# EAGLE design EXT_MAIN (EAGLE 6.5.0)
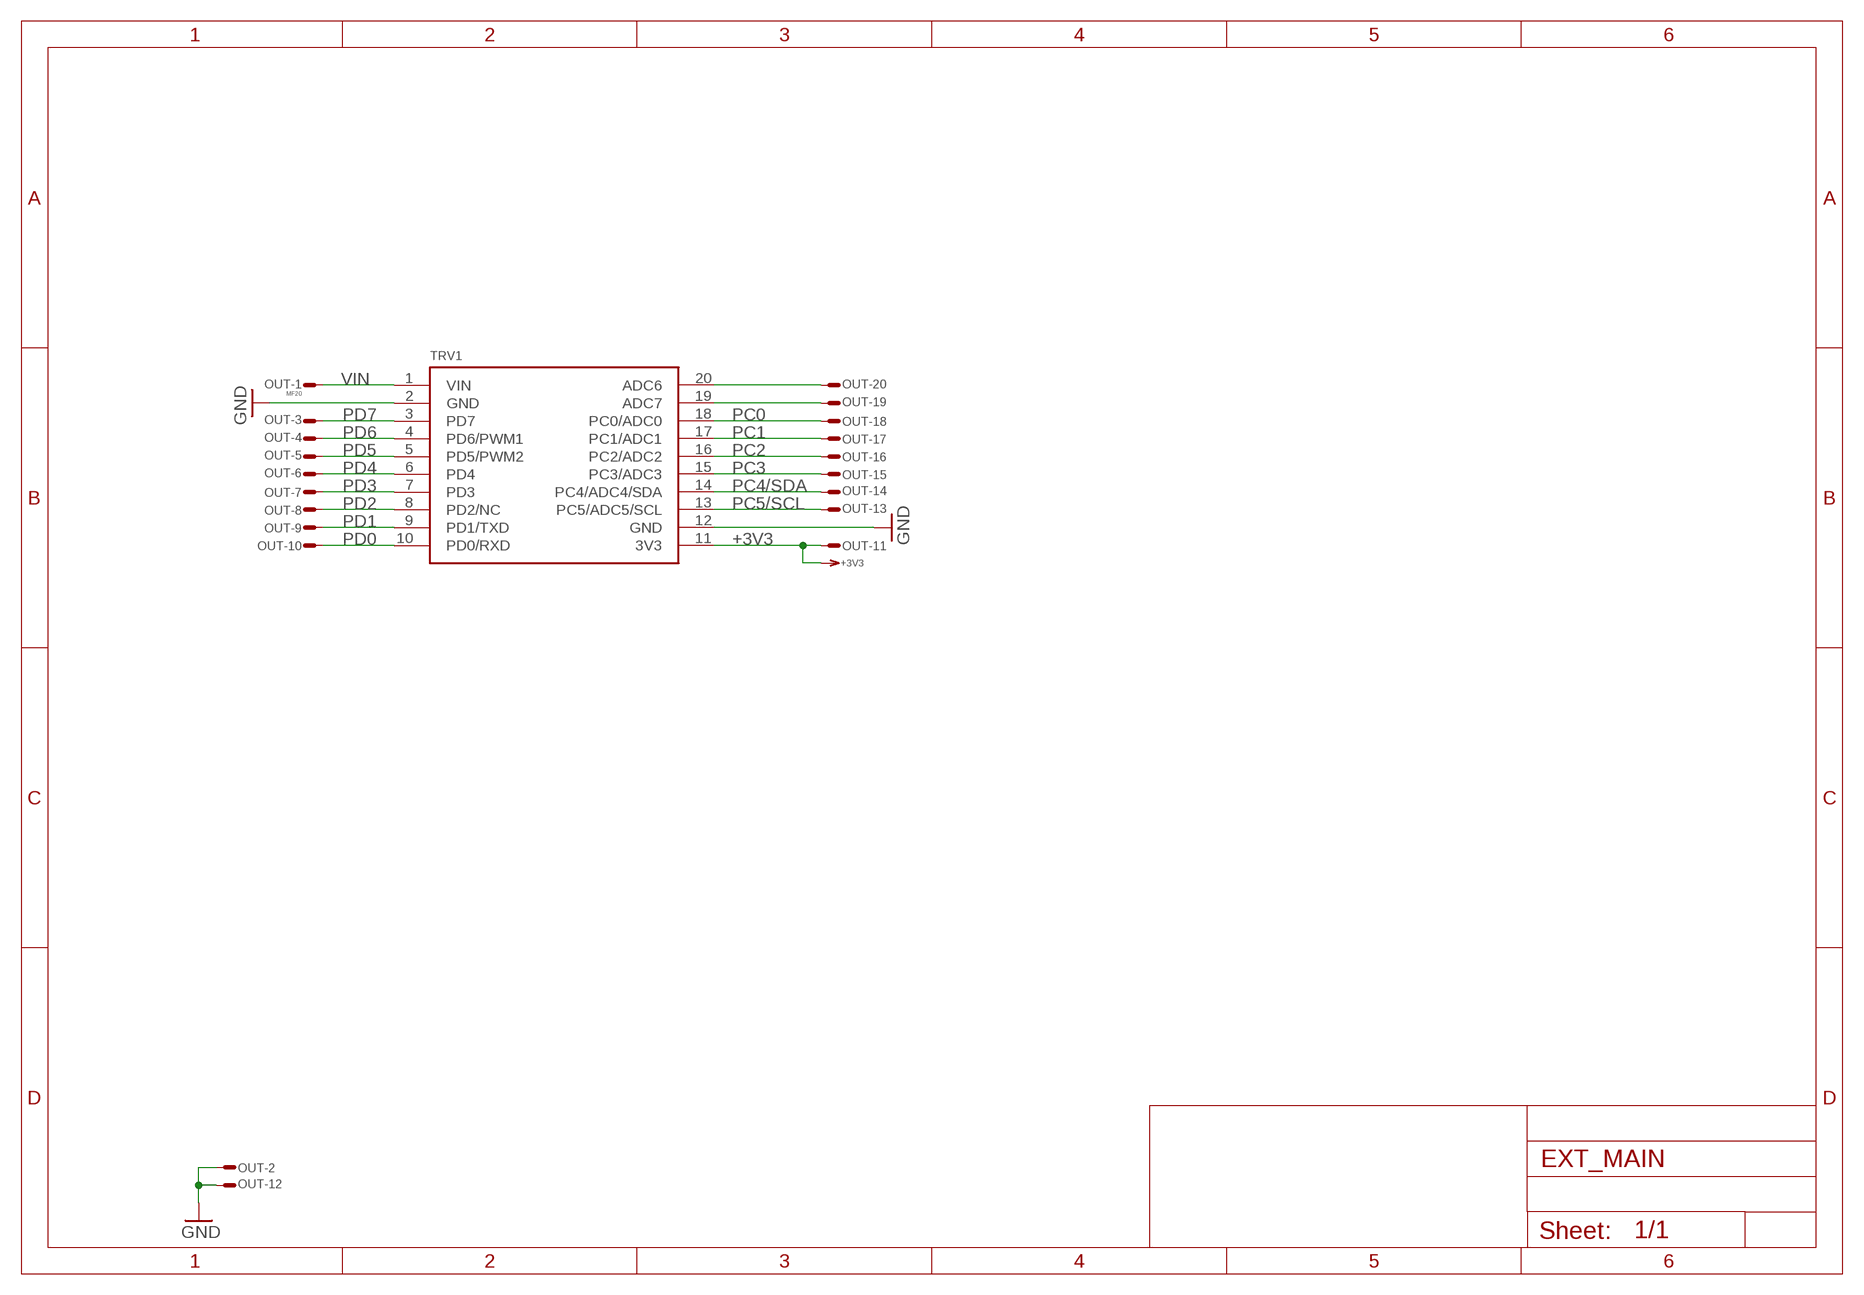
[diagram p0: schematic, sheet 1]

## Parts
OUT  MF20  ML20LSE  [ML20LS]
TRV1  X13_TRV  [X13TRV]

## Nets
+3V3: OUT.P$11 TRV1.11(3V3)
GND: OUT.P$2 OUT.P$12 TRV1.2(GND) TRV1.12(GND)
N$1: OUT.P$20 TRV1.20(ADC6)
N$3: OUT.P$19 TRV1.19(ADC7)
PC0: OUT.P$18 TRV1.18(PC0/ADC0)
PC1: OUT.P$17 TRV1.17(PC1/ADC1)
PC2: OUT.P$16 TRV1.16(PC2/ADC2)
PC3: OUT.P$15 TRV1.15(PC3/ADC3)
PC4/SDA: OUT.P$14 TRV1.14(PC4/ADC4/SDA)
PC5/SCL: OUT.P$13 TRV1.13(PC5/ADC5/SCL)
PD0: OUT.P$10 TRV1.10(PD0/RXD)
PD1: OUT.P$9 TRV1.9(PD1/TXD)
PD2: OUT.P$8 TRV1.8(PD2/NC)
PD3: OUT.P$7 TRV1.7(PD3)
PD4: OUT.P$6 TRV1.6(PD4)
PD5: OUT.P$5 TRV1.5(PD5/PWM2)
PD6: OUT.P$4 TRV1.4(PD6/PWM1)
PD7: OUT.P$3 TRV1.3(PD7)
VIN: OUT.P$1 TRV1.1(VIN)

## Library data of the parts
OUT = Conn:ML20?E: HARTING
TRV1 = Other:X13_TRV

## Board
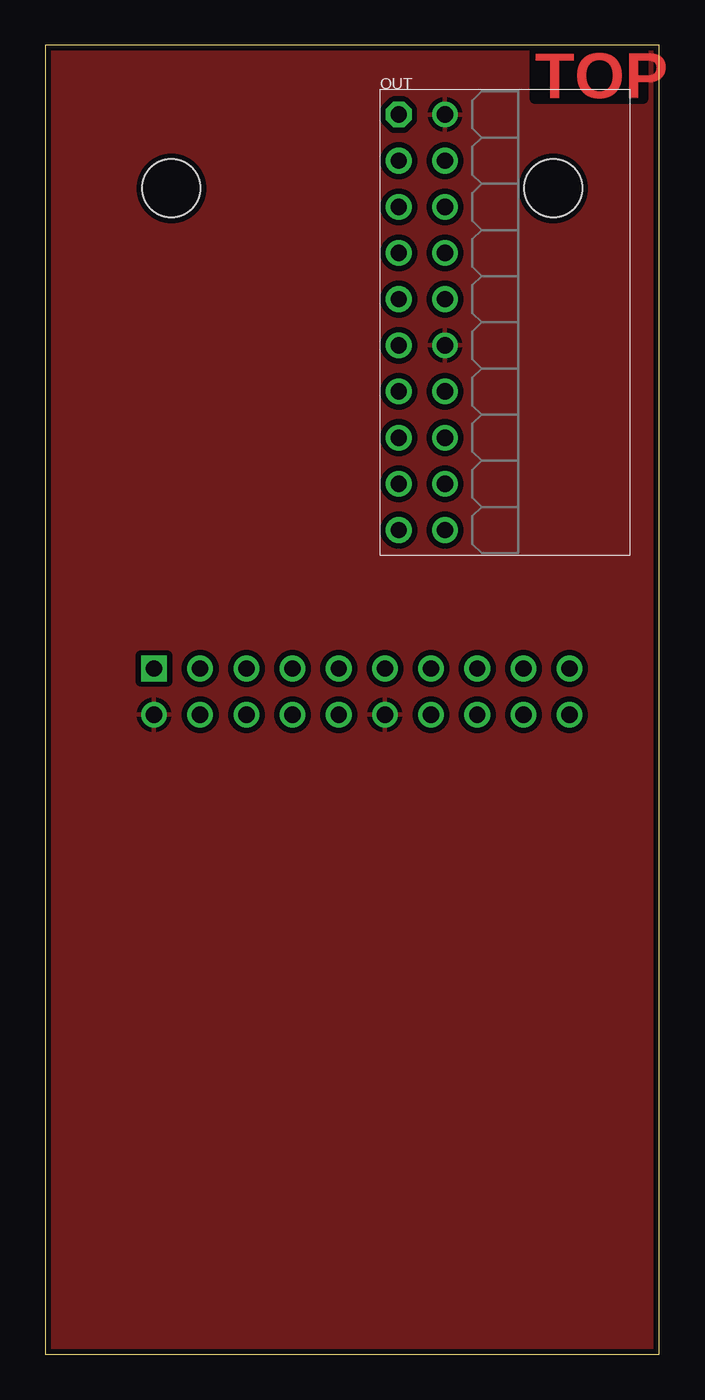
[diagram p1: board, top side]
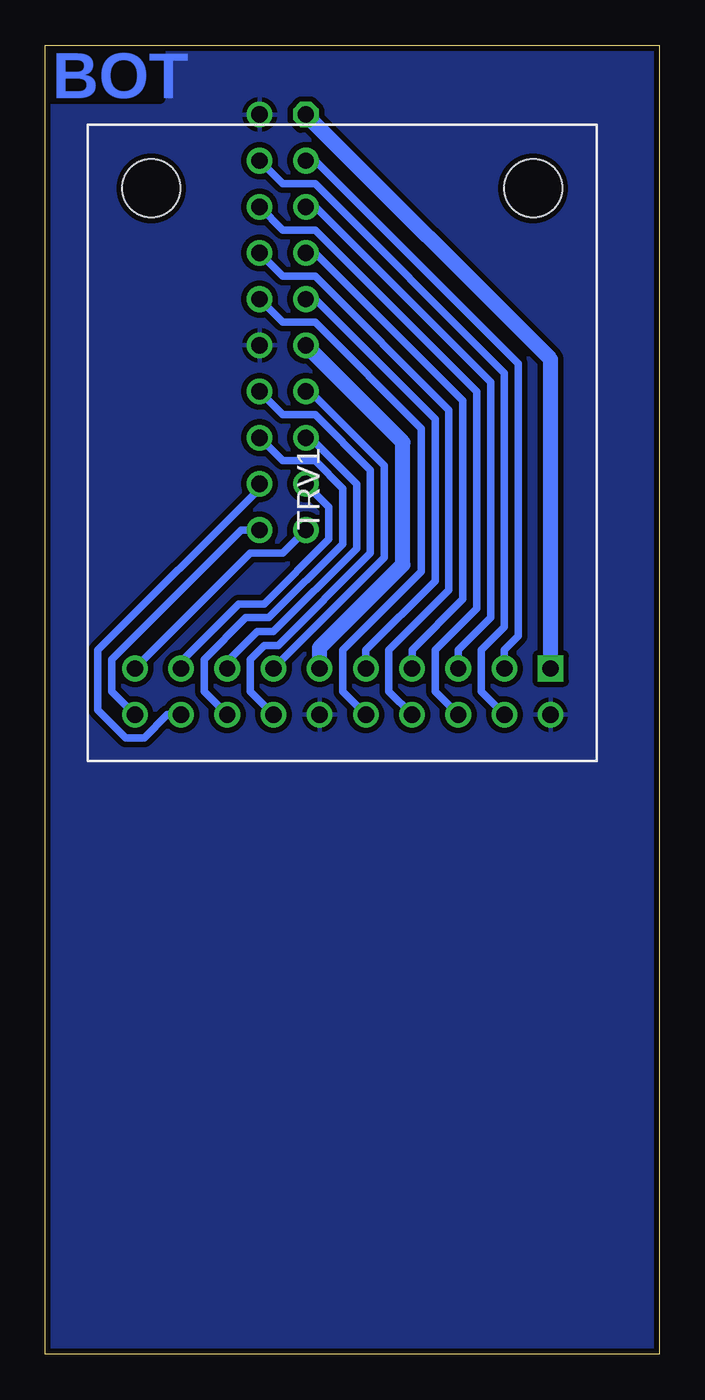
[diagram p2: board, bottom side, seen from below]

Size 33.75 x 72 mm. Coordinates in mm from the lower left corner, seen from the top.
Outline: 0,0 33.75,0 33.75,72 0,72 0,0
Copper layers (1*16): Top 0.035mm / dielectric 1.5mm / Bottom 0.035mm
Design rules "default *": minimum track width 10mil, minimum drill 10mil, track to track 12mil, track to pad 12mil, pad to pad 12mil, via to via 12mil, smd to smd 12mil, copper to edge 12mil, drill to drill 8mil, minimum pad ring 10mil, minimum via ring 8mil, stop-mask expansion 4mil, vias tented up to drill 0mil, thermal gap 10mil
tKeepout: area 0,0 to 33.8,2; area 0,70 to 33.8,72

### Footprints (pad centres in the part's own frame; a part is rotated, then mirrored left to right if it is on the bottom)
ML20LS = drill 0.9 octagon: P$1 -11.43,-1.27 | drill 0.9: P$2 -11.43,1.27; P$3 -8.89,-1.27; P$4 -8.89,1.27; P$5 -6.35,-1.27; P$6 -6.35,1.27; P$7 -3.81,-1.27; P$8 -3.81,1.27; P$9 -1.27,-1.27; P$10 -1.27,1.27; P$11 1.27,-1.27; P$12 1.27,1.27; P$13 3.81,-1.27; P$14 3.81,1.27; P$15 6.35,-1.27; P$16 6.35,1.27; P$17 8.89,-1.27; P$18 8.89,1.27; P$19 11.43,-1.27; P$20 11.43,1.27
X13TRV = drill 0.9 square: 1 5.08,2.54 | drill 0.9: 2 2.54,2.54; 3 5.08,5.08; 4 2.54,5.08; 5 5.08,7.62; 6 2.54,7.62; 7 5.08,10.16; 8 2.54,10.16; 9 5.08,12.7; 10 2.54,12.7; 11 5.08,15.24; 12 2.54,15.24; 13 5.08,17.78; 14 2.54,17.78; 15 5.08,20.32; 16 2.54,20.32; 17 5.08,22.86; 18 2.54,22.86; 19 5.08,25.4; 20 2.54,25.4 | hole 3.2: 31.5,3.5; 31.5,24.5

### Placement (x,y rotation side)
OUT  20.7,56.77 270 top
TRV1  3.43,32.64 90 bottom

### Tracks (layer width: path | path; a pad name or v marks a point on that pad's centre or on a via)
+3V3
  Bottom 0.813: TRV1.11 18.67,38.86 14.1,43.43 14.1,50.16 OUT.P$11
GND
  pour Bottom: 0,0.13 33.66,0.13 33.66,71.88 0,71.88
  pour Top: 0,0 33.66,0 33.66,71.88 0,71.88
N$1
  Bottom 0.406: TRV1.20 30.1,36.45 30.1,38.23 22.99,45.34 OUT.P$20
N$3
  Bottom 0.406: TRV1.19 22.48,44.07 20.7,44.07 OUT.P$19
PC0
  Bottom 0.406: TRV1.18 27.05,35.18 28.32,33.91 29.34,33.91 30.86,35.43 30.86,38.73 21.97,47.62 OUT.P$18
PC1
  Bottom 0.406: TRV1.17 26.29,38.1 23.11,41.27 21.72,41.27 18.16,44.83 18.16,46.61 OUT.P$17
PC2
  Bottom 0.406: TRV1.16 25.02,36.45 25.02,38.23 22.73,40.51 21.46,40.51 17.4,44.58 17.4,47.62 18.92,49.15 20.7,49.15 OUT.P$16
PC3
  Bottom 0.406: TRV1.15 23.75,38.1 22.1,39.75 21.21,39.75 16.64,44.32 16.64,47.88 19.18,50.42 OUT.P$15
PC4/SDA
  Bottom 0.406: TRV1.14 22.48,36.45 22.48,38.23 21.72,38.99 20.95,38.99 15.88,44.07 15.88,48.64 18.92,51.69 20.7,51.69 OUT.P$14
PC5/SCL
  Bottom 0.406: TRV1.13 15.11,43.81 15.11,48.9 19.18,52.96 OUT.P$13
PD0
  Bottom 0.406: TRV1.10 17.4,36.45 17.4,38.73 13.08,43.05 13.08,50.93 18.92,56.77 20.7,56.77 OUT.P$10
PD1
  Bottom 0.406: TRV1.9 16.13,38.73 12.32,42.55 12.32,51.44 18.92,58.04 OUT.P$9
PD2
  Bottom 0.406: TRV1.8 14.86,36.45 14.86,38.73 11.56,42.04 11.56,51.94 18.92,59.31 20.7,59.31 OUT.P$8
PD3
  Bottom 0.406: TRV1.7 13.59,38.73 10.79,41.53 10.79,52.45 18.92,60.58 OUT.P$7
PD4
  Bottom 0.406: TRV1.6 12.32,36.45 12.32,38.73 10.03,41.02 10.03,52.96 18.92,61.85 20.7,61.85 OUT.P$6
PD5
  Bottom 0.406: TRV1.5 11.05,38.73 9.27,40.51 9.27,53.47 18.92,63.12 OUT.P$5
PD6
  Bottom 0.406: TRV1.4 9.78,36.45 9.78,38.73 8.51,40.01 8.51,53.98 18.92,64.39 20.7,64.39 OUT.P$4
PD7
  Bottom 0.406: TRV1.3 8.51,38.73 7.75,39.5 7.75,54.48 18.92,65.66 OUT.P$3
VIN
  Bottom 0.813: TRV1.1 5.97,54.74 OUT.P$1

### Text on the board
Top: TOP
Bottom: BOT